# EAGLE design Test (EAGLE 6.1)
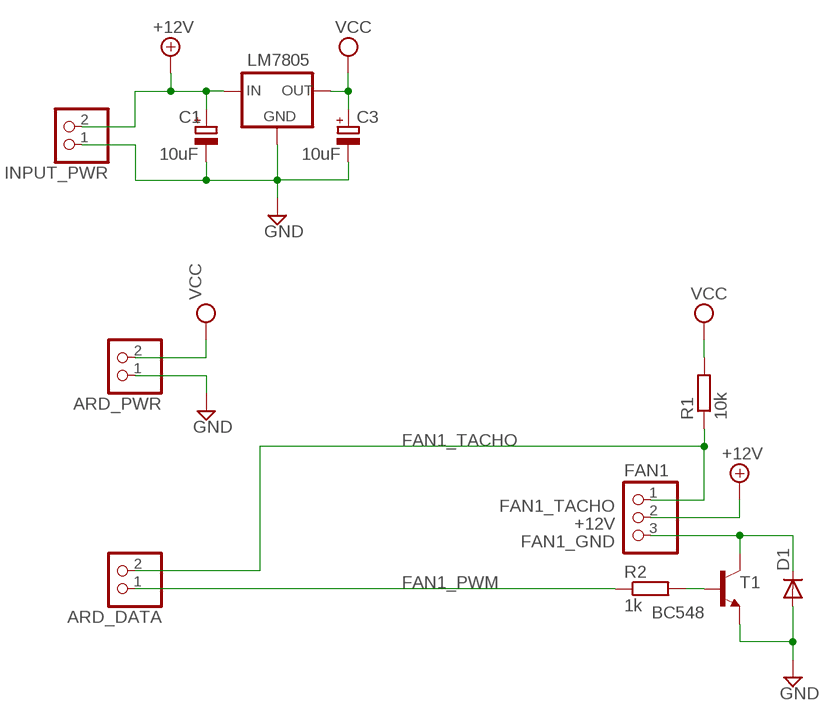
[diagram p0: schematic, sheet 1]

## Parts
ARD_DATA  PINHD-1X2  [1X02]
ARD_PWR  PINHD-1X2  [1X02]
C1  10uF  CPOL-EUE2.5-6  [E2,5-6]
C3  10uF  CPOL-EUE2.5-6  [E2,5-6]
D1  DIODE-D-7.5  [D-7.5]
FAN1  PINHD-1X3  [1X03]
INPUT_PWR  PINHD-1X2  [1X02]
LM7805  78XXL  [78XXL]
R1  10k  R-EU_0207/10  [0207/10]
R2  1k  R-EU_0204/7  [0204/7]
T1  BC548  BC547  [TO92]

## Nets
+12V: C1.+ FAN1.2 INPUT_PWR.2 LM7805.IN
FAN1_GND: D1.C FAN1.3 T1.3(C)
FAN1_PWM: ARD_DATA.1 R2.1
FAN1_TACHO: ARD_DATA.2 FAN1.1 R1.1
GND: ARD_PWR.1 C1.- C3.- D1.A INPUT_PWR.1 LM7805.GND T1.1(E)
N$2: R2.2 T1.2(B)
VCC: ARD_PWR.2 C3.+ LM7805.OUT R1.2

## Library data of the parts
ARD_DATA ARD_PWR INPUT_PWR = EnigmaMon:PINHD-1X2: PIN HEADER
C1 C3 = rcl:CPOL-EU: POLARIZED CAPACITOR, European symbol
D1 = diode:DIODE-: DIODE
FAN1 = pinhead:PINHD-1X3: PIN HEADER
LM7805 = EnigmaMon:78XXL: VOLTAGE REGULATOR
R1 R2 = rcl:R-EU_: RESISTOR, European symbol
T1 = transistor:BC547: NPN TRANSISTOR

## Board
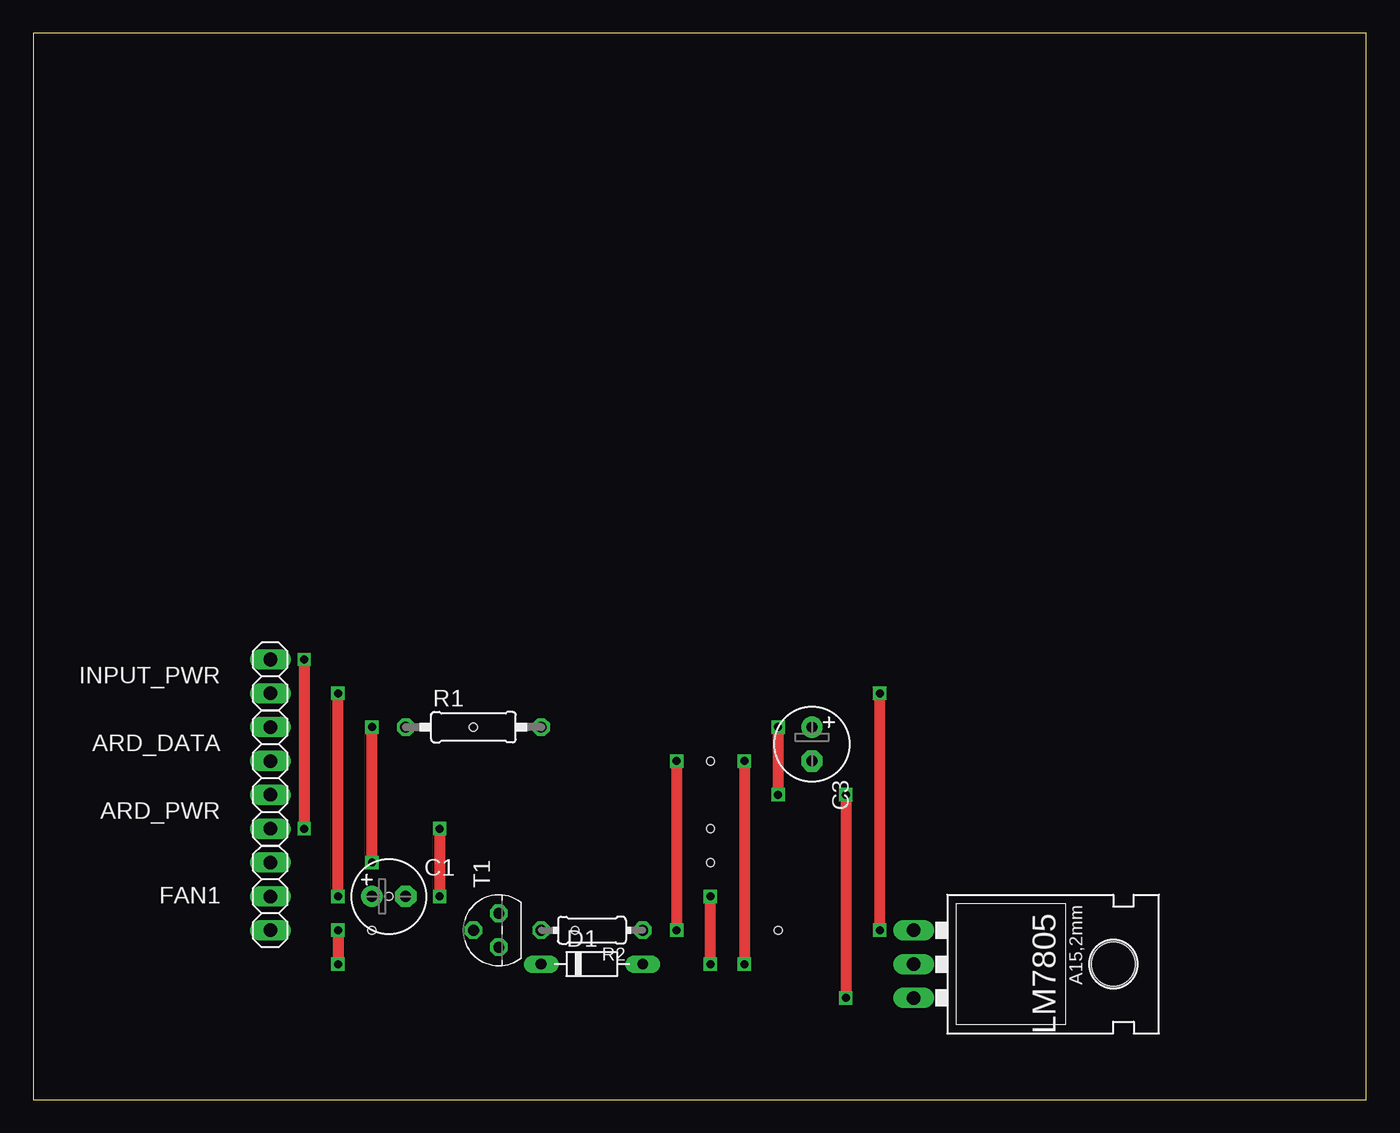
[diagram p1: board, top side]
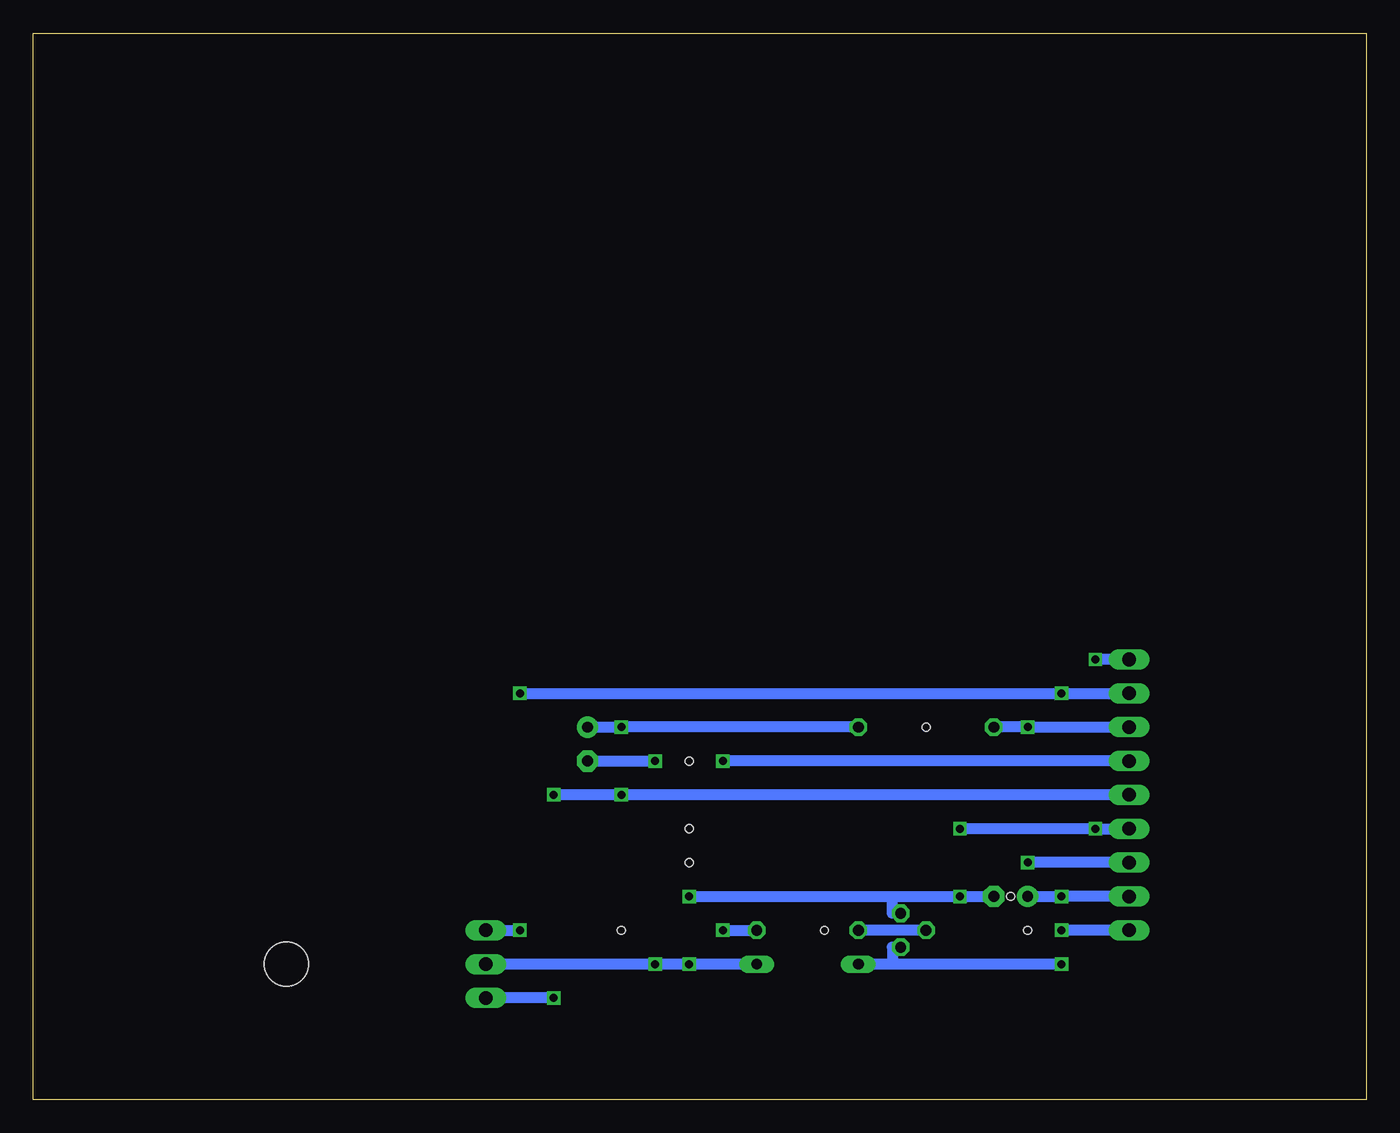
[diagram p2: board, bottom side, seen from below]

Size 100 x 80 mm. Coordinates in mm from the lower left corner, seen from the top.
Outline: 0,0 100,0 100,80 0,80 0,0
Copper layers (1*16): Top 0.035mm / dielectric 1.5mm / Bottom 0.035mm
Design rules: minimum track width 10mil, minimum drill 24mil, track to track 8mil, track to pad 8mil, pad to pad 8mil, via to via 8mil, smd to smd 8mil, copper to edge 40mil, drill to drill 8mil, minimum pad ring 10mil, minimum via ring 8mil, stop-mask expansion 4mil, vias tented up to drill 0mil, thermal gap 10mil
Holes 0.6 mm at 26.67,15.24 33.02,27.94 25.4,12.7 40.64,12.7 50.8,25.4 50.8,20.32 50.8,17.78 55.88,12.7

### Footprints (pad centres in the part's own frame; a part is rotated, then mirrored left to right if it is on the bottom)
1X02 = drill 1.016 long: 1 -1.27,0; 2 1.27,0
E2,5-6 = drill 0.813 pad 1.6: + -1.27,0 | drill 0.813 pad 1.6 octagon: - 1.27,0
D-7.5 = drill 0.813 long: A 3.81,0; C -3.81,0
1X03 = drill 1.016 long: 1 -2.54,0; 2 0,0; 3 2.54,0
78XXL = drill 1.016 long: GND 0,-3.81; IN -2.54,-3.81; OUT 2.54,-3.81 | hole 3.302: 0,11.176
0207/10 = drill 0.813 octagon: 1 -5.08,0; 2 5.08,0
0204/7 = drill 0.813 octagon: 1 -3.81,0; 2 3.81,0
TO92 = drill 0.813 octagon: 1 1.27,0; 2 0,1.905; 3 -1.27,0

### Placement (x,y rotation side)
ARD_DATA  17.78,26.67 90 top
ARD_PWR  17.78,21.59 90 top
C1  26.67,15.24 0 top
C3  58.42,26.67 270 top
D1  41.91,10.16 0 top
FAN1  17.78,15.24 270 top
INPUT_PWR  17.78,31.75 270 top
LM7805  69.85,10.16 270 top
R1  33.02,27.94 0 top
R2  41.91,12.7 180 top
T1  34.92,12.7 90 top

### Tracks (layer width: path | path; a pad name or v marks a point on that pad's centre or on a via)
+12V  (via drill 0.6)
  Top 0.813: v22.86,15.24 v22.86,30.48 | v63.5,12.7 v63.5,30.48
  Bottom 0.813: FAN1.2 v22.86,15.24 C1.+ | INPUT_PWR.2 v22.86,30.48 v63.5,30.48 | LM7805.IN v63.5,12.7
FAN1_GND  (via drill 0.6)
  Top 0.813: v22.86,12.7 v22.86,10.16
  Bottom 0.813: FAN1.3 v22.86,12.7 | v22.86,10.16 35.56,10.16 | T1.3 35.56,11.43 35.56,10.16 | 35.56,10.16 D1.C
FAN1_PWM  (via drill 0.6)
  Top 0.813: v48.26,25.4 v48.26,12.7
  Bottom 0.813: ARD_DATA.1 v48.26,25.4 | v48.26,12.7 R2.1
FAN1_TACHO  (via drill 0.6)
  Top 0.813: v25.4,17.78 v25.4,27.94
  Bottom 0.813: FAN1.1 v25.4,17.78 | ARD_DATA.2 v25.4,27.94 R1.1
GND  (via drill 0.6)
  Top 0.813: v30.48,20.32 v30.48,15.24 | v53.34,25.4 v53.34,10.16 | v20.32,33.02 v20.32,20.32 | v50.8,10.16 v50.8,15.24
  Bottom 0.813: v30.48,20.32 v20.32,20.32 ARD_PWR.1 | C1.- v30.48,15.24 35.56,15.24 | T1.1 35.56,13.97 35.56,15.24 | v53.34,10.16 D1.A v50.8,10.16 LM7805.GND | C3.- v53.34,25.4 | INPUT_PWR.1 v20.32,33.02 | v50.8,15.24 35.56,15.24
N$2
  Bottom 0.813: T1.2 R2.2
VCC  (via drill 0.6)
  Top 0.813: v60.96,22.86 v60.96,7.62 | v55.88,27.94 v55.88,22.86
  Bottom 0.813: ARD_PWR.2 v55.88,22.86 v60.96,22.86 | v60.96,7.62 LM7805.OUT | R1.2 v55.88,27.94 C3.+